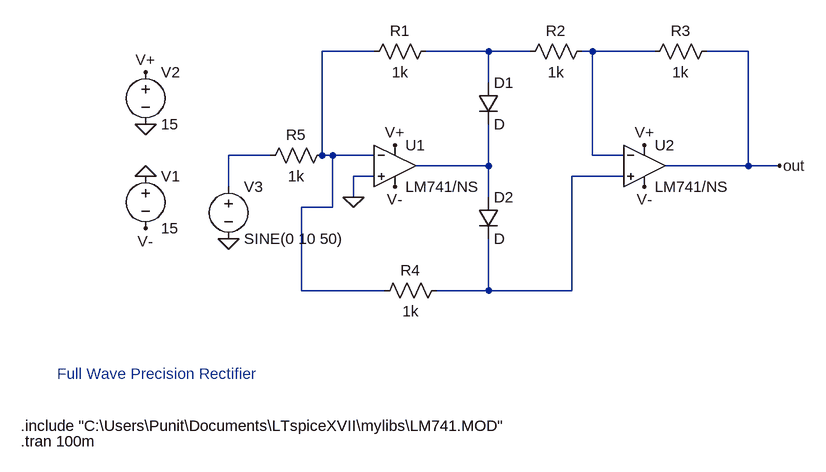
[diagram p0: schematic full_wave_precision_rectifier.asc]
full_wave_precision_rectifier.asc, the LTspice schematic file:
Version 4
SHEET 1 880 680
WIRE 64 16 -16 16
WIRE 240 16 144 16
WIRE 304 16 240 16
WIRE 400 16 384 16
WIRE 496 16 400 16
WIRE 640 16 576 16
WIRE 240 64 240 16
WIRE -96 176 -160 176
WIRE -16 176 -16 16
WIRE 0 176 -16 176
WIRE 64 176 0 176
WIRE 400 176 400 16
WIRE 448 176 400 176
WIRE 240 192 240 128
WIRE 240 192 128 192
WIRE 640 192 640 16
WIRE 640 192 512 192
WIRE 688 192 640 192
WIRE 64 208 32 208
WIRE 448 208 368 208
WIRE -160 224 -160 176
WIRE 32 240 32 208
WIRE 240 240 240 192
WIRE 0 256 0 176
WIRE 0 256 -48 256
WIRE -48 384 -48 256
WIRE 80 384 -48 384
WIRE 240 384 240 304
WIRE 240 384 160 384
WIRE 368 384 368 208
WIRE 368 384 240 384
FLAG 32 240 0
FLAG -288 128 0
FLAG -288 208 0
FLAG -288 48 V+
FLAG -288 288 V-
FLAG 96 160 V+
FLAG 480 160 V+
FLAG 96 224 V-
FLAG 480 224 V-
FLAG -160 304 0
FLAG 688 192 out
SYMBOL OpAmps\\opamp2 96 128 R0
SYMATTR InstName U1
SYMATTR Value LM741/NS
SYMBOL OpAmps\\opamp2 480 128 R0
SYMATTR InstName U2
SYMATTR Value LM741/NS
SYMBOL diode 224 64 R0
SYMATTR InstName D1
SYMBOL diode 224 240 R0
SYMATTR InstName D2
SYMBOL res 160 0 R90
WINDOW 0 0 56 VBottom 2
WINDOW 3 32 56 VTop 2
SYMATTR InstName R1
SYMATTR Value 1k
SYMBOL res 400 0 R90
WINDOW 0 0 56 VBottom 2
WINDOW 3 32 56 VTop 2
SYMATTR InstName R2
SYMATTR Value 1k
SYMBOL res 592 0 R90
WINDOW 0 0 56 VBottom 2
WINDOW 3 32 56 VTop 2
SYMATTR InstName R3
SYMATTR Value 1k
SYMBOL voltage -288 192 R0
WINDOW 123 0 0 Left 0
WINDOW 39 0 0 Left 0
SYMATTR InstName V1
SYMATTR Value 15
SYMBOL voltage -288 32 R0
WINDOW 123 0 0 Left 0
WINDOW 39 0 0 Left 0
SYMATTR InstName V2
SYMATTR Value 15
SYMBOL res 176 368 R90
WINDOW 0 0 56 VBottom 2
WINDOW 3 32 56 VTop 2
SYMATTR InstName R4
SYMATTR Value 1k
SYMBOL res 0 160 R90
WINDOW 0 0 56 VBottom 2
WINDOW 3 32 56 VTop 2
SYMATTR InstName R5
SYMATTR Value 1k
SYMBOL voltage -160 208 R0
WINDOW 123 0 0 Left 0
WINDOW 39 0 0 Left 0
SYMATTR InstName V3
SYMATTR Value SINE(0 10 50)
TEXT -480 592 Left 2 !.include "C:\\Users\\Punit\\Documents\\LTspiceXVII\\mylibs\\LM741.MOD"
TEXT -480 616 Left 2 !.tran 100m
TEXT -424 512 Left 2 ;Full Wave Precision Rectifier

The netlist it stands for:
* full_wave_precision_rectifier.asc
XU1 0 N001 V+ V- N005 LM741/NS  ; pins In+ In- V+ V- OUT
XU2 N006 N003 V+ V- out LM741/NS  ; pins In+ In- V+ V- OUT
D1 N002 N005 D
D2 N005 N006 D
R1 N002 N001 1k
R2 N003 N002 1k
R3 out N003 1k
V1 0 V- 15
V2 V+ 0 15
R4 N006 N001 1k
R5 N001 N004 1k
V3 N004 0 SINE(0 10 50)
.model D D
.lib standard.dio
.include "C:\Users\Punit\Documents\LTspiceXVII\mylibs\LM741.MOD"
.tran 100m
* Full Wave Precision Rectifier
.backanno
.end